# EAGLE design Konektor LCD (EAGLE 7.2.0)
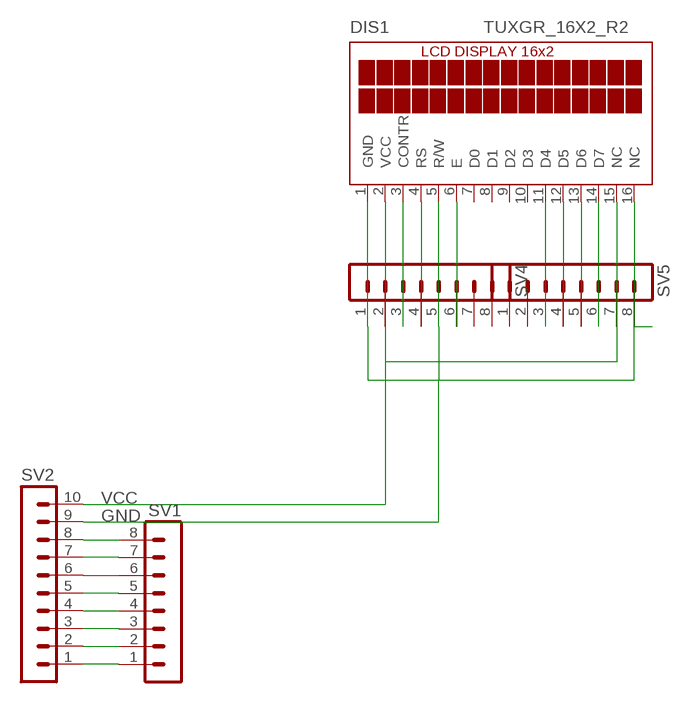
[diagram p0: schematic, sheet 1]

## Parts
DIS1  TUXGR_16X2_R2  [TUXGR_16X2_R2]
SV1  MA08-1  [MA08-1]
SV2  MA10-1  [MA10-1]
SV4  MA08-1  [MA08-1]
SV5  MA08-1  [MA08-1]

## Nets
GND: DIS1.1(GND) DIS1.5(R/W) DIS1.16(NC) SV2.9 SV4.1 SV4.5 SV5.8
N$1: SV1.1 SV2.1
N$2: SV1.2 SV2.2
N$3: SV1.3 SV2.3
N$4: SV1.4 SV2.4
N$5: SV1.5 SV2.5
N$7: SV1.6 SV2.6
N$8: SV1.7 SV2.7
N$9: SV1.8 SV2.8
N$11: DIS1.3(CONTR) SV4.3
N$12: DIS1.4(RS) SV4.4
N$13: DIS1.6(E) SV4.6
N$15: DIS1.14(D7) SV5.6
N$16: DIS1.13(D6) SV5.5
N$17: DIS1.12(D5) SV5.4
N$18: DIS1.11(D4) SV5.3
VCC: DIS1.2(VCC) DIS1.15(NC) SV2.10 SV4.2 SV5.7
Unconnected: DIS1.7(D0) DIS1.8(D1) DIS1.9(D2) DIS1.10(D3) SV4.7 SV4.8 SV5.1 SV5.2

## Library data of the parts
DIS1 = display-lcd:TUXGR_16X2_R2: Tuxgraphics LCD display 16x2 characters reflective, without background light Source: tuxgr_12x2_r2.pdf; OC_FARNELL: unknown; OC_NEWARK: unknown
SV1 SV4 SV5 = con-lstb:MA08-1: PIN HEADER; OC_FARNELL: unknown; OC_NEWARK: unknown
SV2 = con-lstb:MA10-1: PIN HEADER; OC_FARNELL: unknown; OC_NEWARK: unknown

## Net classes
0 default: width 0.051 mm, clearance 0.051 mm

## Board
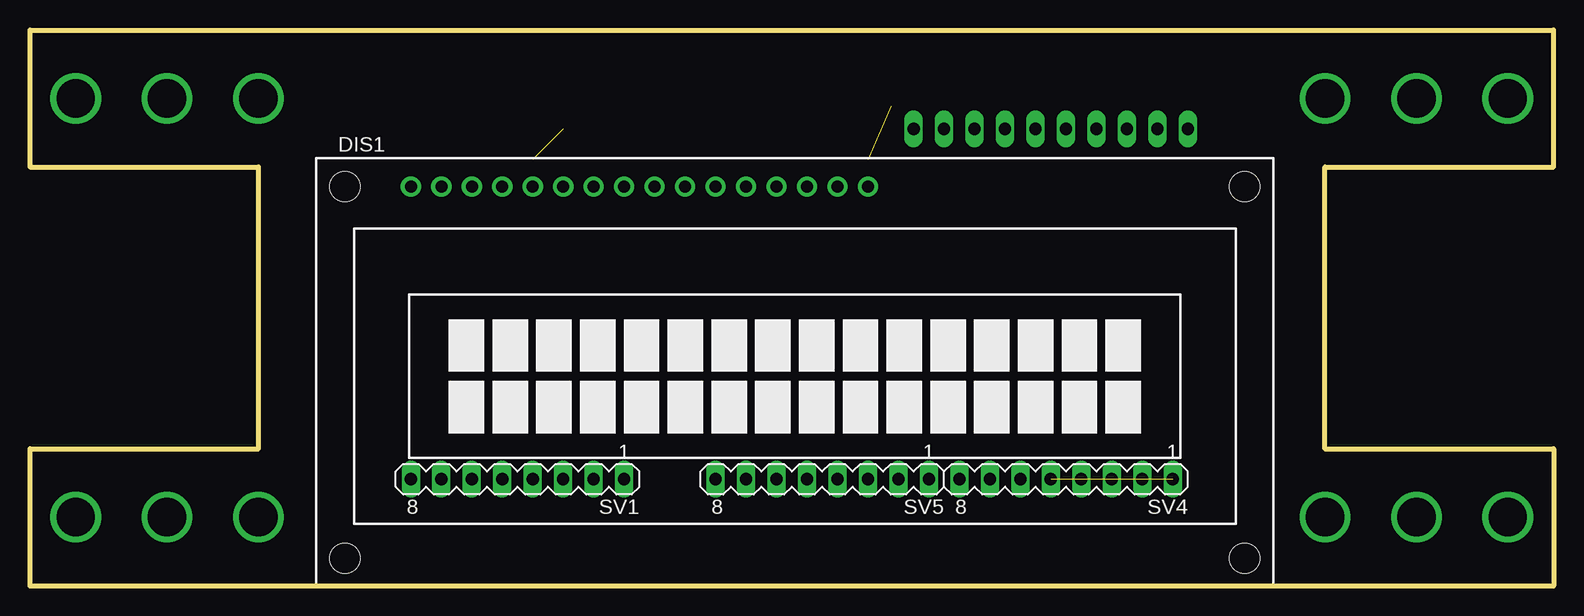
[diagram p1: board, top side]
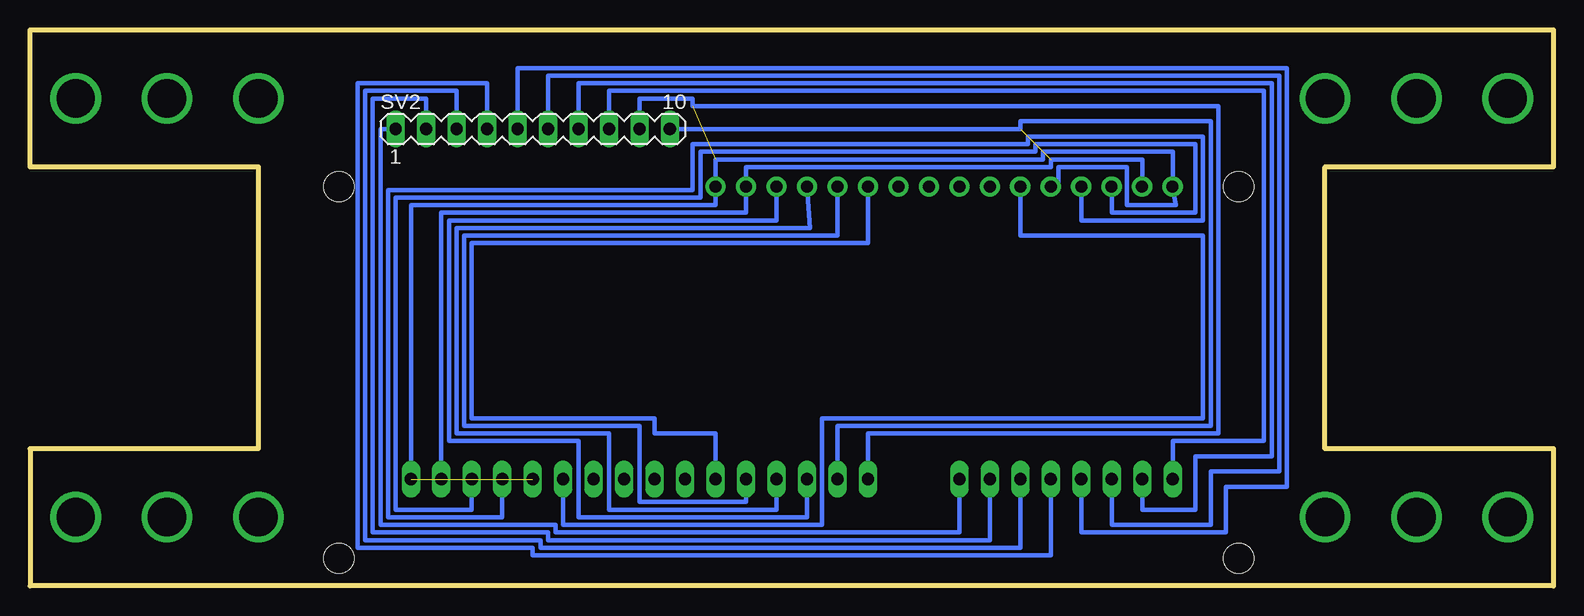
[diagram p2: board, bottom side, seen from below]

Size 127 x 46.35 mm. Coordinates in mm from the lower left corner, seen from the top.
Outline: 0,0 0,11.43 19.05,11.43 19.05,34.92 0,34.92 0,46.35 127,46.35 127,34.92 107.95,34.92 107.95,11.43 127,11.43 127,0 0,0
Copper layers (1*16): Top 0.035mm / dielectric 1.5mm / Bottom 0.035mm
Design rules "default *": minimum track width 20mil, minimum drill 24mil, track to track 8mil, track to pad 8mil, pad to pad 8mil, via to via 8mil, smd to smd 8mil, copper to edge 40mil, drill to drill 8mil, minimum pad ring 10mil, minimum via ring 8mil, stop-mask expansion 4mil, vias tented up to drill 0mil, thermal gap 10mil

### Footprints (pad centres in the part's own frame; a part is rotated, then mirrored left to right if it is on the bottom)
TUXGR_16X2_R2 = drill 1 pad 1.676: 1 -32,15.5; 2 -29.46,15.5; 3 -26.92,15.5; 4 -24.38,15.5; 5 -21.84,15.5; 6 -19.3,15.5; 7 -16.76,15.5; 8 -14.22,15.5; 9 -11.68,15.5; 10 -9.14,15.5; 11 -6.6,15.5; 12 -4.06,15.5; 13 -1.52,15.5; 14 1.02,15.5; 15 3.56,15.5; 16 6.1,15.5 | hole 2.5: -37.5,-15.5; 37.5,-15.5; -37.5,15.5; 37.5,15.5
MA08-1 = drill 1.016 long: 1 -8.89,0; 2 -6.35,0; 3 -3.81,0; 4 -1.27,0; 5 1.27,0; 6 3.81,0; 7 6.35,0; 8 8.89,0
MA10-1 = drill 1.016 long: 1 -11.43,0; 2 -8.89,0; 3 -6.35,0; 4 -3.81,0; 5 -1.27,0; 6 1.27,0; 7 3.81,0; 8 6.35,0; 9 8.89,0; 10 11.43,0

### Placement (x,y rotation side)
DIS1  63.75,17.78 0 top
SV1  40.64,8.89 180 top
SV2  85.09,38.1 0 bottom
SV4  86.36,8.89 180 top
SV5  66.04,8.89 180 top

### Tracks (layer width: path | path; a pad name or v marks a point on that pad's centre or on a via)
A  (via drill 3.2)
  other vias: 123.19,40.64
GND  (2 unrouted)
  Bottom 0.356: DIS1.5 41.27,33.28 41.27,34.92 35.56,34.92 35.56,31.75 31.5,31.75 DIS1.1 31.75,36.19 42.55,36.19 42.55,35.56 69.85,35.56 DIS1.16 69.85,31.75 95.25,31.75 SV4.1 | SV5.8 57.15,12.7 27.94,12.7 27.94,40 71.76,40 71.76,40.64 76.2,40.64 SV2.9
N$1
  Bottom 0.356: SV2.1 97.79,38.1 97.79,5.08 83.19,5.08 83.19,4.44 49.53,4.44 SV1.1
N$2
  Bottom 0.356: SV1.2 46.99,3.81 83.82,3.81 83.82,4.44 98.43,4.44 98.43,40.64 93.98,40.64 SV2.2
N$3
  Bottom 0.356: SV2.3 91.44,41.28 99.06,41.28 99.06,3.81 84.46,3.81 84.46,3.17 44.45,3.17 SV1.3
N$4
  Bottom 0.356: SV2.4 88.9,41.91 99.7,41.91 99.7,3.17 85.09,3.17 85.09,2.54 41.91,2.54 SV1.4
N$5
  Bottom 0.356: SV1.5 39.37,4.44 27.3,4.44 27.3,8.25 22.23,8.25 22.23,43.18 86.36,43.18 SV2.5
N$6  (via drill 3.2)
  other vias: 3.81,5.72
N$7
  Bottom 0.356: SV2.6 83.82,42.54 22.86,42.54 22.86,9.52 28.57,9.52 28.57,5.08 36.83,5.08 SV1.6
N$8
  Bottom 0.356: SV1.7 34.29,6.35 29.84,6.35 29.84,10.8 23.49,10.8 23.49,41.91 81.28,41.91 SV2.7
N$9
  Bottom 0.356: SV2.8 78.74,41.28 24.13,41.28 24.13,12.06 31.75,12.06 SV1.8
N$10  (via drill 3.2)
  other vias: 11.43,5.72
N$11
  Bottom 0.356: DIS1.3 36.83,31.12 29.84,31.12 29.84,36.83 43.18,36.83 43.18,36.19 71.12,36.19 71.12,32.38 96.52,32.38 96.52,6.35 90.17,6.35 SV4.3
N$12
  Bottom 0.356: DIS1.4 39.37,30.48 29.21,30.48 29.21,37.47 43.81,37.47 43.81,36.83 71.76,36.83 71.76,33.02 97.16,33.02 97.16,5.72 87.63,5.72 SV4.4
N$13
  Bottom 0.356: DIS1.6 44.45,29.21 29.21,29.21 29.21,13.97 60.96,13.97 60.96,5.08 82.55,5.08 SV4.6
N$15
  Bottom 0.356: DIS1.14 64.77,30.48 92.08,30.48 92.08,12.06 81.28,12.06 81.28,5.72 62.23,5.72 SV5.6
N$16
  Bottom 0.356: SV5.5 64.77,6.35 78.74,6.35 78.74,12.7 91.44,12.7 91.44,29.84 61.98,29.84 DIS1.13
N$17
  Bottom 0.356: DIS1.12 59.69,29.21 90.81,29.21 90.81,13.34 76.2,13.34 76.2,6.98 67.31,6.98 SV5.4
N$18
  Bottom 0.356: DIS1.11 57.15,28.57 90.17,28.57 90.17,13.97 74.93,13.97 74.93,12.7 69.85,12.7 SV5.3
N$19  (via drill 3.2)
  other vias: 19.05,5.72
N$20  (via drill 3.2)
  other vias: 11.43,40.64
N$21  (via drill 3.2)
  other vias: 19.05,40.64
N$22  (via drill 3.2)
  other vias: 3.81,40.64
N$23  (via drill 3.2)
  other vias: 123.19,5.72
N$24  (via drill 3.2)
  other vias: 107.95,40.64
N$26  (via drill 3.2)
  other vias: 115.57,40.64
N$27  (via drill 3.2)
  other vias: 107.95,5.72
N$28  (via drill 3.2)
  other vias: 115.57,5.72
VCC  (1 unrouted)
  Bottom 0.356: DIS1.2 34.29,35.56 41.91,35.56 41.91,34.92 67.31,34.92 DIS1.15 67.31,31.12 92.71,31.12 SV4.2 | SV5.7 59.69,13.34 28.57,13.34 28.57,38.73 44.45,38.73 44.45,38.1 SV2.10